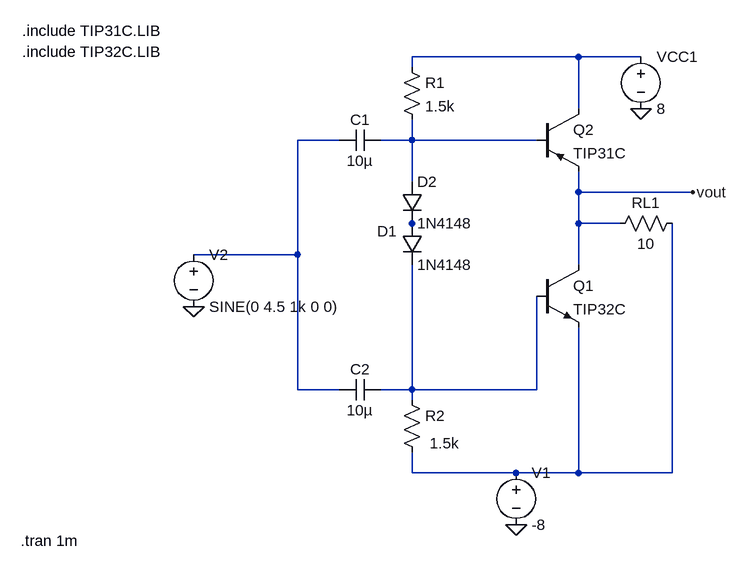
[diagram p0: schematic power-amp.asc]
power-amp.asc, the LTspice schematic file:
Version 4
SHEET 1 880 680
WIRE 384 -160 128 -160
WIRE 480 -160 384 -160
WIRE 128 -144 128 -160
WIRE 384 -80 384 -160
WIRE 16 -32 -48 -32
WIRE 128 -32 128 -64
WIRE 128 -32 80 -32
WIRE 320 -32 128 -32
WIRE 128 32 128 -32
WIRE 384 48 384 16
WIRE 560 48 384 48
WIRE 384 96 384 48
WIRE 448 96 384 96
WIRE 128 112 128 96
WIRE -48 144 -48 -32
WIRE -48 144 -208 144
WIRE 384 160 384 96
WIRE -48 352 -48 144
WIRE 16 352 -48 352
WIRE 128 352 128 160
WIRE 128 352 80 352
WIRE 320 352 320 208
WIRE 320 352 128 352
WIRE 128 368 128 352
WIRE 128 480 128 448
WIRE 288 480 128 480
WIRE 384 480 384 256
WIRE 384 480 288 480
WIRE 528 480 528 96
WIRE 528 480 384 480
FLAG 480 -80 0
FLAG 288 560 0
FLAG -208 224 0
FLAG 560 48 vout
SYMBOL res 112 -160 R0
SYMATTR InstName R1
SYMATTR Value 1.5k
SYMBOL res 112 352 R0
WINDOW 3 43 82 Left 2
SYMATTR Value 1.5k
SYMATTR InstName R2
SYMBOL res 544 80 R90
WINDOW 0 0 56 VBottom 2
WINDOW 3 32 56 VTop 2
SYMATTR InstName RL1
SYMATTR Value 10
SYMBOL voltage 480 -176 R0
WINDOW 123 0 0 Left 0
WINDOW 39 0 0 Left 0
SYMATTR InstName VCC1
SYMATTR Value 8
SYMBOL diode 112 96 R0
WINDOW 0 -38 12 Left 2
SYMATTR InstName D1
SYMATTR Value 1N4148
SYMBOL diode 112 32 R0
SYMATTR InstName D2
SYMATTR Value 1N4148
SYMBOL voltage 288 464 R0
WINDOW 123 0 0 Left 0
WINDOW 39 0 0 Left 0
SYMATTR InstName V1
SYMATTR Value -8
SYMBOL cap 80 -48 R90
WINDOW 0 0 32 VBottom 2
WINDOW 3 32 32 VTop 2
SYMATTR InstName C1
SYMATTR Value 10µ
SYMBOL cap 80 336 R90
WINDOW 0 0 32 VBottom 2
WINDOW 3 32 32 VTop 2
SYMATTR InstName C2
SYMATTR Value 10µ
SYMBOL npn 320 160 R0
SYMATTR InstName Q1
SYMATTR Value TIP32C
SYMBOL pnp 320 -80 R0
SYMATTR InstName Q2
SYMATTR Value TIP31C
SYMBOL voltage -208 128 R0
WINDOW 123 0 0 Left 0
WINDOW 39 0 0 Left 0
SYMATTR InstName V2
SYMATTR Value SINE(0 4.5 1k 0 0)
TEXT -472 -168 Left 2 !.include TIP32C.LIB
TEXT -472 -200 Left 2 !.include TIP31C.LIB
TEXT -474 584 Left 2 !.tran 1m

The netlist it stands for:
* power-amp.asc
R1 N001 N003 1.5k
R2 N005 N006 1.5k
RL1 N006 vout 10
VCC1 N001 0 8
D1 N004 N005 1N4148
D2 N003 N004 1N4148
V1 N006 0 -8
C1 N003 N002 10µ
C2 N005 N002 10µ
Q1 vout N005 N006 0 TIP32C
Q2 N001 N003 vout 0 TIP31C
V2 N002 0 SINE(0 4.5 1k 0 0)
.model D D
.lib standard.dio
.model NPN NPN
.model PNP PNP
.lib standard.bjt
.include TIP32C.LIB
.include TIP31C.LIB
.tran 1m
.backanno
.end